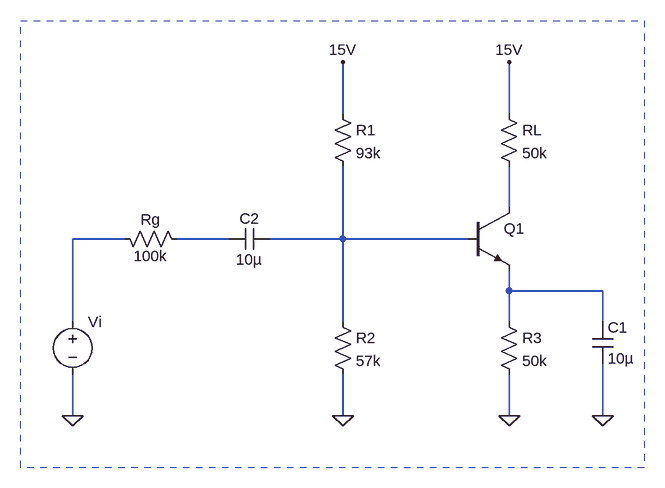
[diagram p0: schematic Ej 5-5.asc]
Ej 5-5.asc, the LTspice schematic file:
Version 4
SHEET 1 9348 6404
WIRE 3376 2000 3376 1920
WIRE 3632 2000 3632 1920
WIRE 3632 2144 3632 2080
WIRE 3040 2192 2960 2192
WIRE 3200 2192 3120 2192
WIRE 3376 2192 3376 2080
WIRE 3376 2192 3264 2192
WIRE 3568 2192 3376 2192
WIRE 3632 2272 3632 2240
WIRE 3776 2272 3632 2272
WIRE 2960 2320 2960 2192
WIRE 3376 2320 3376 2192
WIRE 3632 2320 3632 2272
WIRE 3776 2320 3776 2272
WIRE 2960 2464 2960 2400
WIRE 3376 2464 3376 2400
WIRE 3632 2464 3632 2400
WIRE 3776 2464 3776 2384
FLAG 3632 2464 0
FLAG 3776 2464 0
FLAG 3376 2464 0
FLAG 2960 2464 0
FLAG 3376 1920 15V
FLAG 3632 1920 15V
SYMBOL npn 3568 2144 R0
WINDOW 3 56 68 Invisible 2
SYMATTR Value BC547C
SYMATTR InstName Q1
SYMBOL res 3616 2304 R0
SYMATTR InstName R3
SYMATTR Value 50k
SYMBOL cap 3760 2320 R0
SYMATTR InstName C1
SYMATTR Value 10µ
SYMBOL res 3616 1984 R0
SYMATTR InstName RL
SYMATTR Value 50k
SYMBOL res 3360 1984 R0
SYMATTR InstName R1
SYMATTR Value 93k
SYMBOL res 3360 2304 R0
SYMATTR InstName R2
SYMATTR Value 57k
SYMBOL cap 3200 2176 M90
WINDOW 0 0 32 VBottom 2
WINDOW 3 32 32 VTop 2
SYMATTR InstName C2
SYMATTR Value 10µ
SYMBOL res 3024 2176 M90
WINDOW 0 2 56 VBottom 2
WINDOW 3 27 56 VTop 2
SYMATTR InstName Rg
SYMATTR Value 100k
SYMBOL voltage 2960 2304 R0
WINDOW 3 24 96 Invisible 2
SYMATTR Value ""
SYMATTR Value2 AC 1
SYMATTR InstName Vi
RECTANGLE Normal 3840 2544 2880 1856 2

The netlist it stands for:
* Ej 5-5.asc
Q1 N001 N004 N005 0 BC547C
R3 N005 0 50k
C1 N005 0 10µ
RL 15V N001 50k
R1 15V N004 93k
R2 N004 0 57k
C2 N003 N004 10µ
Rg N002 N003 100k
Vi N002 0 AC 1
.model NPN NPN
.model PNP PNP
.lib standard.bjt
.backanno
.end